# EasyEDA Pro project 车板子.epro

# Schematic Schematic1
Board Name: Board1; Create Date: 2025-12-30; Page Name: P1; Project Name: 毕设; Schematic Name: Schematic1; Update Date: 2026-01-01; Company: 嘉立创EDA; Page Size: A1; Version: V1.0
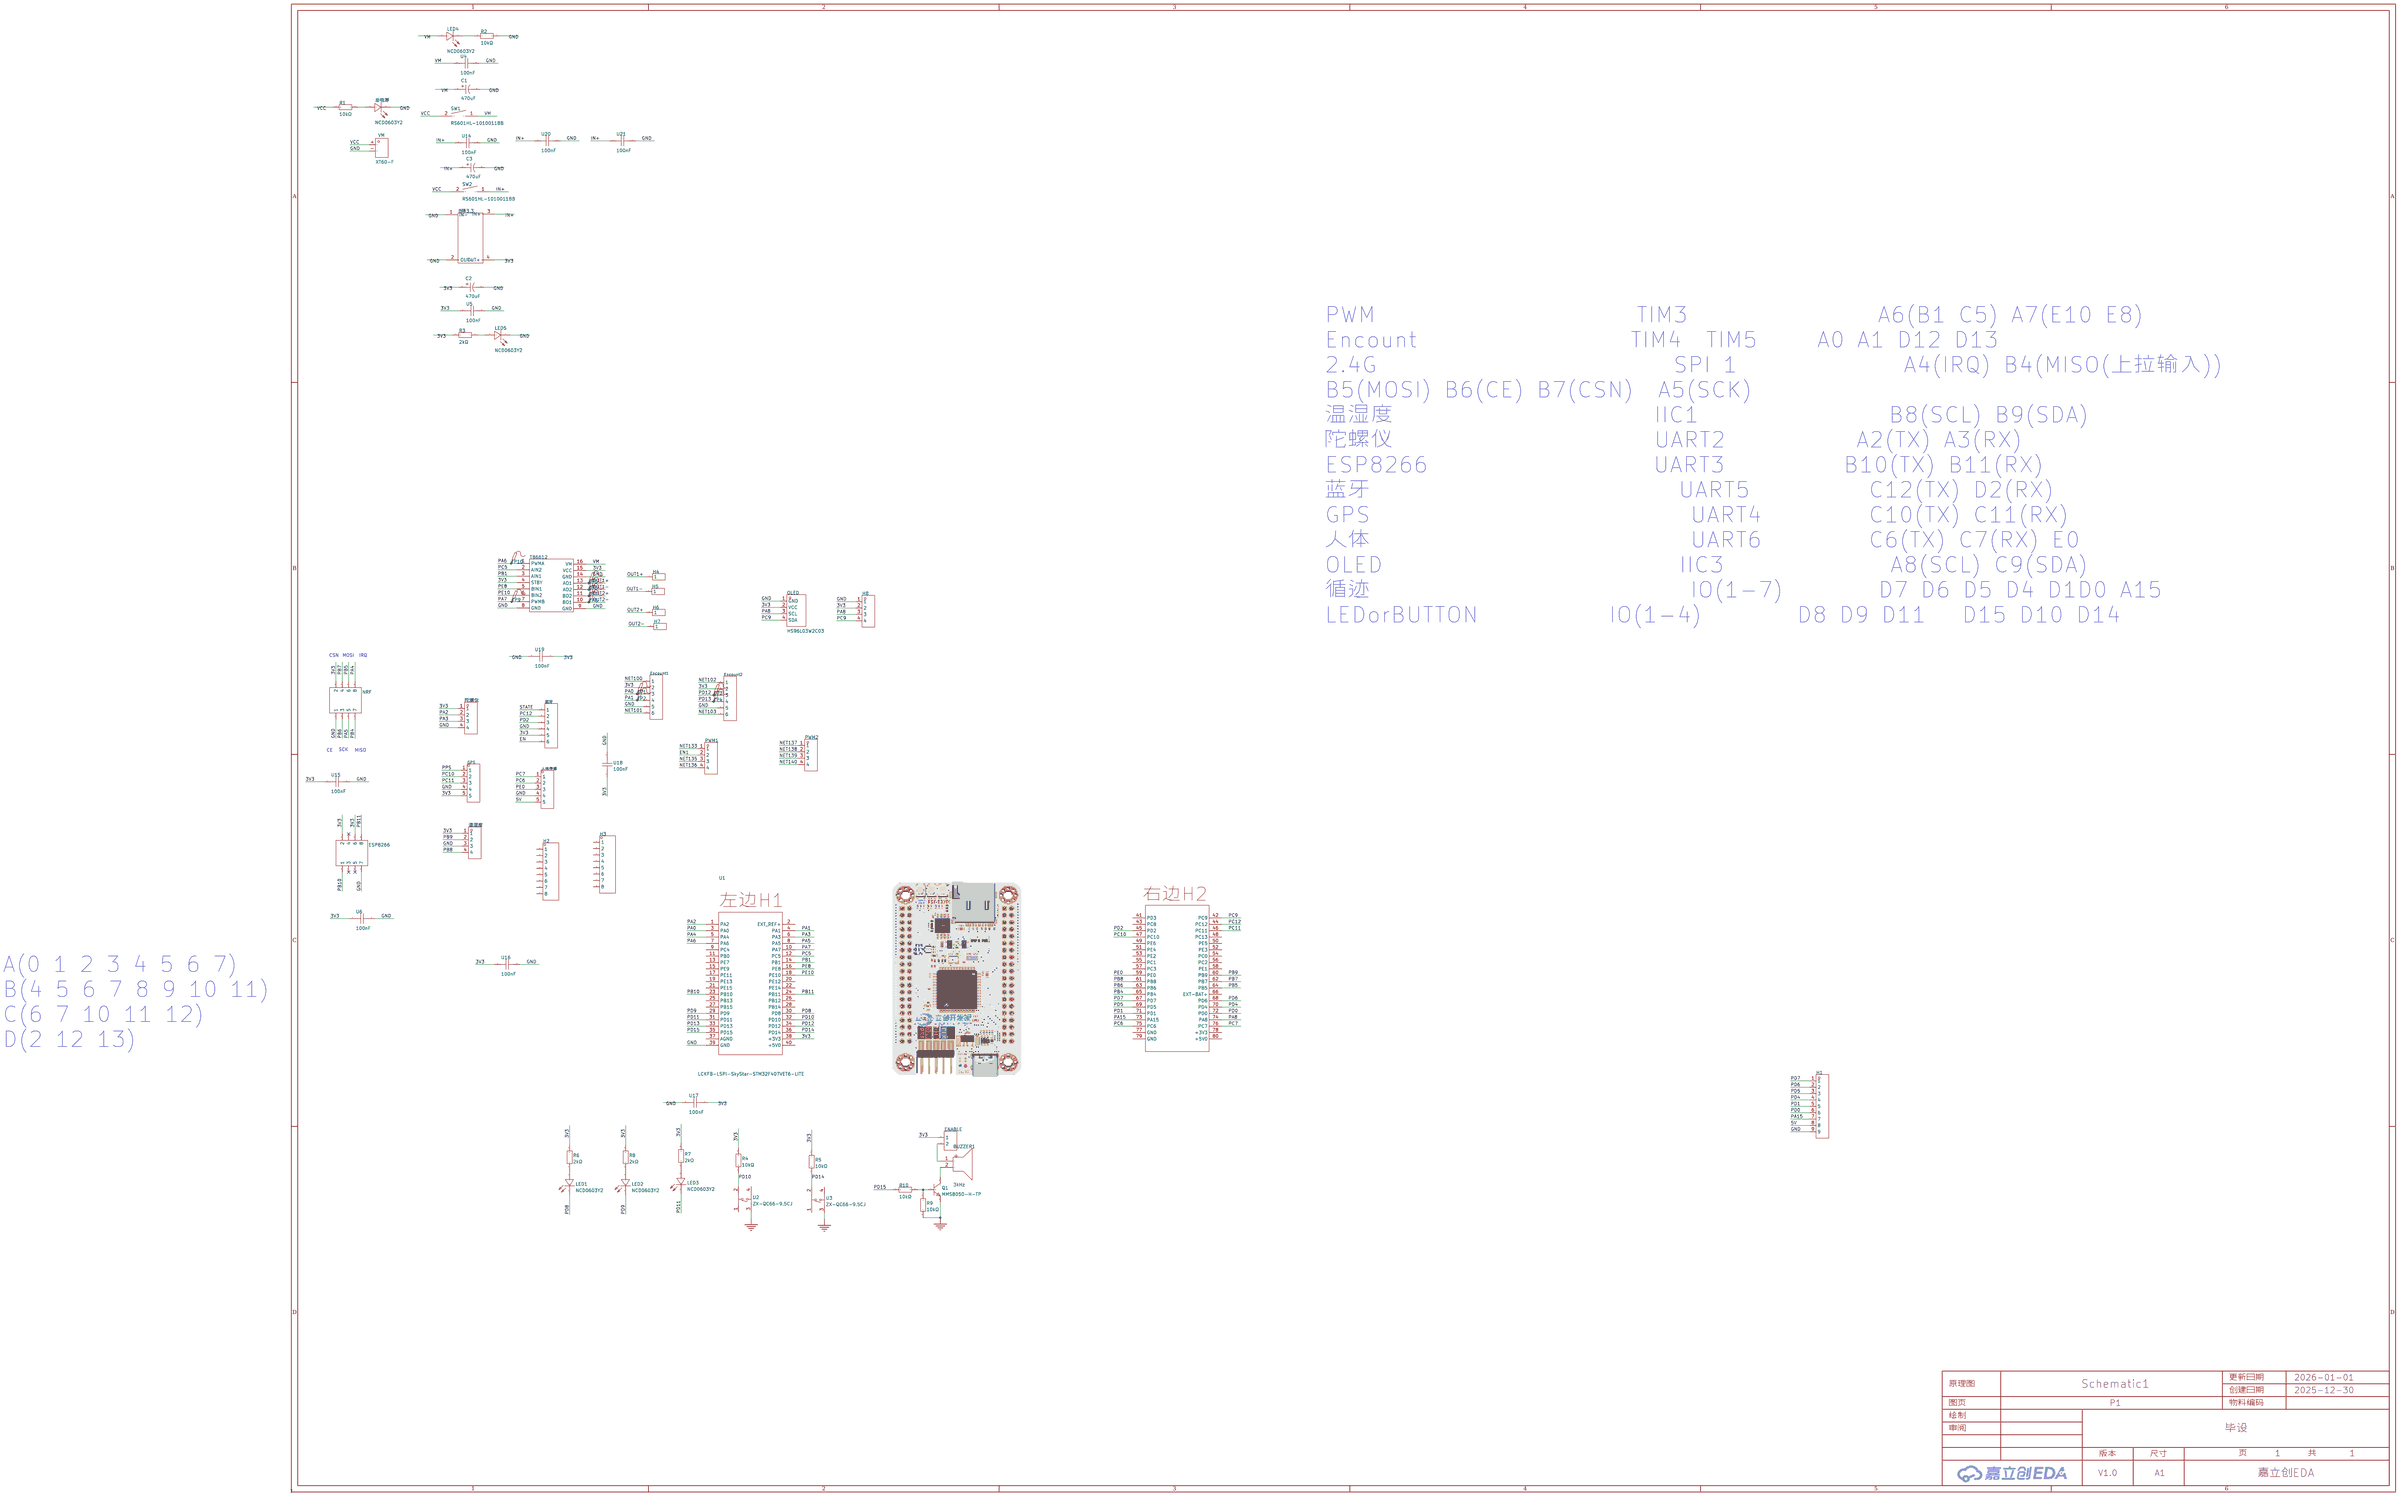
[diagram p0: schematic sheet]

## Parts
8降3.3  -  [DCDC]
BUZZER1  3kHz  [BUZ-TH_BD9.0-P5.00-D0.6-FD]
C1  470uF  [CAP-TH_BD8.0-P3.50-D0.6-FD_1]
C2  470uF  [CAP-TH_BD8.0-P3.50-D0.6-FD_1]
C3  470uF  [CAP-TH_BD8.0-P3.50-D0.6-FD_1]
ENABLE  -  [HDR-TH_2P-P2.54-V-F]
Encount1  -  [HDR-TH_6P-P2.54-V-M-1]
Encount2  -  [HDR-TH_6P-P2.54-V-M-1]
ESP8266  -  [HDR-TH_8P-P2.54-V-F-R2-C4-S2.54-1]
GPS  -  [HDR-TH_5P-P2.54-V-M]
H1  -  [HDR-TH_9P-P2.54-V-M]
H2  -  [HDR-TH_8P-P2.54-V-M]
H3  -  [HDR-TH_8P-P2.54-V-M]
H4  -  [HDR-TH_1P-V-M_XKB_X4611WV-01I-C28D40]
H5  -  [HDR-TH_1P-V-M_XKB_X4611WV-01I-C28D40]
H6  -  [HDR-TH_1P-V-M_XKB_X4611WV-01I-C28D40]
H7  -  [HDR-TH_1P-V-M_XKB_X4611WV-01I-C28D40]
H8  -  [HDR-TH_4P-P2.54-V-M]
LED1  NCD0603Y2  [LED0603-RD]
LED2  NCD0603Y2  [LED0603-RD]
LED3  NCD0603Y2  [LED0603-RD]
LED4  NCD0603Y2  [LED0603-RD]
LED5  NCD0603Y2  [LED0603-RD]
NRF  -  [HDR-TH_8P-P2.54-V-F-R2-C4-S2.54-1]
OLED  HS96L03W2C03  [OLED-TH_L27.8-W27.2-P2.54_C9900033791]
PWM1  -  [HDR-TH_4P-P2.54-V-M]
PWM2  -  [HDR-TH_4P-P2.54-V-M]
Q1  MMS8050-H-TP  [SOT-23-3_L2.9-W1.3-P1.90-LS2.4-BR]
R1  10kΩ  [R0603]
R2  10kΩ  [R0603]
R3  2kΩ  [R0603]
R4  10kΩ  [R0603]
R5  10kΩ  [R0603]
R6  2kΩ  [R0603]
R7  2kΩ  [R0603]
R8  2kΩ  [R0603]
R9  10kΩ  [R0603]
R10  10kΩ  [R0603]
SW1  RS601HL-1010011BB  [SW-TH_RS601HL-1010011BB]
SW2  RS601HL-1010011BB  [SW-TH_RS601HL-1010011BB]
TB6612  -  [TB6612模块]
TP1  -  [Test-Point-0.5mm]
TP2  -  [Test-Point-0.5mm]
TP3  -  [Test-Point-0.5mm]
TP4  -  [Test-Point-0.5mm]
TP5  -  [Test-Point-0.5mm]
TP6  -  [Test-Point-0.5mm]
TP7  -  [Test-Point-0.5mm]
TP8  -  [Test-Point-0.5mm]
TP9  -  [Test-Point-0.5mm]
TP10  -  [Test-Point-0.5mm]
U1  LCKFB-LSPI-SkyStar-STM32F407VET6-LITE  [COMM-TH_LCKFB-LSPI-SKYSTAR-STM32F407VET6-LITE]
U2  ZX-QC66-9.5CJ  [SW-TH_4P-L6.0-W6.0-P4.50-LS6.3]
U3  ZX-QC66-9.5CJ  [SW-TH_4P-L6.0-W6.0-P4.50-LS6.3]
U4  100nF  [C0603]
U5  100nF  [C0603]
U6  100nF  [C0603]
U14  100nF  [C0603]
U15  100nF  [C0603]
U16  100nF  [C0603]
U17  100nF  [C0603]
U18  100nF  [C0603]
U19  100nF  [C0603]
U20  100nF  [C0603]
U21  100nF  [C0603]
VM  XT60-F  [CONN-TH_XT60PB-F]
人体传感  -  [HDR-TH_5P-P2.54-V-M]
总电源  NCD0603Y2  [LED0603-RD]
温湿度  -  [HDR-TH_4P-P2.54-V-M]
蓝牙  -  [HDR-TH_6P-P2.54-V-M-1]
陀螺仪  -  [HDR-TH_4P-P2.54-V-M]

## Library data of the parts
8降3.3 = DCDC
BUZZER1 = HNB09A03: 驱动方式:有源(内含驱动线路);构造类型:电磁式;频率:3kHz;声压(SPL):85dB;; LCSC Part Name: 电磁式有源一体蜂鸣器HNB09A03; Supplier Part: C96102; Manufacturer: 华能; Supplier Footprint: 插件,D=9mm; JLCPCB Part Class: 扩展库; Datasheet: https://item.szlcsc.com/datasheet/HNB09A03/97306.html; Supplier: LCSC; Driver Circuitry: 有源(内含驱动线路); Technology: 电磁式; Voltage - Supply: 1.5V~4.5V; Current Consumption: 30mA; Sound Pressure Level(SPL): 85dB; Diameter(φD): 9mm; Height: 5.5mm; Operating Temperature: -20℃~+70℃
C1-C3 = CD2884771EM0812VFL: 容值:470uF;精度:±20%;额定电压:25V;纹波电流:905mA@100kHz;等效串联电阻(ESR):69mΩ@100kHz;; LCSC Part Name: 470uF ±20% 25V; Supplier Part: C2960233; Manufacturer: HRK(鸿瑞凯电子); Supplier Footprint: 插件,D8xL12mm; JLCPCB Part Class: 扩展库; Datasheet: https://item.szlcsc.com/datasheet/CD2884771EM0812VFL/3346945.html; Supplier: LCSC; Tolerance: ±20%; Voltage Rating: 25V; Ripple Current: 905mA@100kHz; Equivalent Series Resistance(ESR): 69mΩ@100kHz; Pin Spacing: 3.5mm; Diameter: 8mm; Height - Seated (Max): 12mm; Lifetime: 3000hrs@105℃; Operating Temperature: -40℃~+105℃
ENABLE = HDR-F_2.54_1x2P: Supplier Part: C49661; Supplier Footprint: 插件
Encount1 Encount2 蓝牙 = HDR-M_2.54_1x6P: Supplier Part: C37208; Supplier Footprint: 插件
ESP8266 NRF = HDR-F_2.54_2x4: Supplier Part: C92271; Supplier Footprint: 插件
GPS 人体传感 = HDR-M_2.54_1x5P: Supplier Part: C358687; Supplier Footprint: 插件
H1 = HDR-M_2.54-1x9P: Supplier Part: C492408; Supplier Footprint: 插件
H2 H3 = HDR-M_2.54_1x8P: Supplier Part: C124381; Supplier Footprint: 插件
H4-H7 = HDR-M_2.54_1x1P: Supplier Part: C81276; Supplier Footprint: 插件; JLCPCB Part Class: Extended Part
H8 PWM1 PWM2 温湿度 陀螺仪 = HDR-M_2.54_1x4P: Supplier Part: C492403; Supplier Footprint: 插件
LED1-LED5 总电源 = NCD0603Y2: 发光颜色:黄色;正向电压(VF):1.6V~2.6V;功率:65mW;正向电流:20mA;主波长:586nm~595nm;透镜颜色:无色透明透镜;发光强度:100mcd~220mcd;发光角度:130°;工作温度:-30℃~+85℃;; Supplier Part: C89811; Manufacturer: 国星光电; Supplier Footprint: 0603; JLCPCB Part Class: 扩展库; Datasheet: https://atta.szlcsc.com/upload/public/pdf/source/20200820/C89811_7FE84B429B6BCA3E113B125EE1452576.pdf; Supplier: LCSC; Emitted Color: 黄色; Forward Voltage (VF): 1.6V~2.6V; Power Dissipation: 65mW; Forward Current: 20mA; Dominant Wavelength: 586nm~595nm; Lens Color: 无色透明透镜; Luminous Intensity: 100mcd~220mcd; Viewing Angle: 130°; Operating Temperature: -30℃~+85℃
OLED = HS96L03W2C03: 主控芯片:SSD1315;接口类型:I2C;尺寸(inch):0.96;像素分辨率:128x64;; LCSC Part Name: 0.96寸OLED显示屏窄白光IIC; Supplier Part: C5248080; Manufacturer: HS(汉昇); JLCPCB Part Class: 扩展库; Datasheet: https://atta.szlcsc.com/upload/public/pdf/source/20230627/763D01F79A90007632F098068C7C8AD9.pdf; Supplier: LCSC; Main Control Chip: SSD1315; Interface Type: I2C; Size: 0.96; Pixel Resolution: 128x64; Operating Temperature: -40℃~+70℃
Q1 = MMS8050-H-TP: 晶体管类型:NPN;集电极电流(Ic):500mA;集射极击穿电压(Vceo):25V;耗散功率(Pd):300mW;直流电流增益(hFE):120@50mA,1V;; Supplier Part: C668971; Manufacturer: MCC(美微科); Supplier Footprint: SOT-23; JLCPCB Part Class: 扩展库; Datasheet: https://atta.szlcsc.com/upload/public/pdf/source/20200618/C668971_E8C4278A0C61D2294D468F2197C24659.pdf; Supplier: LCSC; type: NPN; Current - Collector(Ic): 500mA; Collector - Emitter Voltage VCEO: 25V; Pd - Power Dissipation: 300mW; DC Current Gain: 120@50mA,1V; Transition frequency(fT): 150MHz; Current - Collector Cutoff: 100nA; Vce Saturation(VCE(sat)): 600mV; Operating Temperature: -55℃~+150℃@(Tj)
R1-R10 = 0603WAF4701T5E: 电阻类型:厚膜电阻;阻值:4.7kΩ;精度:±1%;功率:100mW;工作电压:75V;温度系数:±100ppm/℃;; LCSC Part Name: 4.7kΩ ±1% 100mW 厚膜电阻; Supplier Part: C23162; Manufacturer: UNI-ROYAL(厚声); Supplier Footprint: 0603; JLCPCB Part Class: 基础库; Datasheet: https://item.szlcsc.com/datasheet/0603WAF4701T5E/23889.html; Supplier: LCSC; Type: 厚膜电阻; Tolerance: ±1%; Power(Watts): 100mW; Voltage-Supply(Max): 75V; Temperature Coefficient: ±100ppm/℃; Operating Temperature: -55℃~+155℃
SW1 SW2 = RS601HL-1010011BB: 带灯:无;引脚样式:焊片;额定电流:3A;额定电压(AC):250V;额定电压(DC):-;电路结构:单刀单掷;机械寿命:1万次;; Supplier Part: C2885782; Manufacturer: HCTL(华灿天禄); Supplier Footprint: 插件; JLCPCB Part Class: 扩展库; Datasheet: https://atta.szlcsc.com/upload/public/pdf/source/20210820/B1970E40D09304D7FA648AE2099FB3E8.pdf; Supplier: LCSC; Switch Length: 15mm; Switch Width: 10.5mm; Switch Height: 11.7mm; Actuator Type: 凹面弯曲; With Lamp: 无; Pin Style: 焊片; Actuator Color: 黑色; Contact Current: 3A; Voltage Rating (AC): 250V; Circuit: 单刀单掷; Mechanical Life: 1万次; Operating Temperature: -25℃~+85℃; Actuator Identifier: - O
TB6612 = TB6612模块
TP1-TP10 = Test-Point: Test Point 测试点
U1 = LCKFB-LSPI-SkyStar-STM32F407VET6-LITE: 单板,不送排针; LCSC Part Name: 立创·天空星开发板-STM32F407VET6-青春版; Supplier Part: C22370035; Manufacturer: 立创开发板; JLCPCB Part Class: Extended Part; Datasheet: https://item.szlcsc.com/datasheet/LCKFB-LSPI-SkyStar-STM32F407VET6-LITE/23849165.html; Supplier: LCSC
U2 U3 = ZX-QC66-9.5CJ: 电路结构:单刀单掷;按钮形状:圆形按钮;作用力:2.6N;安装方式:直插;开关长度:6mm;开关宽度:6mm;开关高度:9.5mm;带支架:不带支架;触点电流:50mA;额定电压:12V;工作寿命:10万次;; LCSC Part Name: 6*6*9.5插件; Supplier Part: C7470135; Manufacturer: Megastar(兆星); Supplier Footprint: 插件; JLCPCB Part Class: 扩展库; Datasheet: https://item.szlcsc.com/datasheet/ZX-QC66-9.5CJ/8519141.html; Supplier: LCSC; Circuit: 单刀单掷; Actuator Style: 圆形按钮; Operating Force: 2.6N; Mounting Type: 直插; Length: 6mm; Width: 6mm; Switch Height: 9.5mm; with Bracket: 不带支架; Contact Current: 50mA; Voltage Rating: 12V; Actuator/Cap Color: 黑色; Termination Style: PC引脚; Life: 10万次; Operating Temperature: -30℃~+80℃
U4-U6 U14-U21 = VJ0603A470FXACW1BC: 容值:47pF;精度:±1%;额定电压:50V;温度系数:C0G;; LCSC Part Name: 47pF ±1% 50V; Supplier Part: C3848767; Manufacturer: VISHAY(威世); Supplier Footprint: 0603; JLCPCB Part Class: 扩展库; Datasheet: https://item.szlcsc.com/datasheet/VJ0603A470FXACW1BC/4417253.html; Supplier: LCSC; Tolerance: ±1%; Voltage Rating: 50V; Temperature Coefficient: C0G
VM = XT60-F: 类别:-;类型1:-;; LCSC Part Name: AMASS(艾迈斯)XT60模型插头 3.5mm镀金香蕉头母头 XT60-F; Supplier Part: C98734; Manufacturer: AMASS(艾迈斯); JLCPCB Part Class: 扩展库; Datasheet: https://atta.szlcsc.com/upload/public/pdf/source/20170606/1496716532533.pdf; Supplier: LCSC; Type: 香蕉头; Colour: 黄色; InterfaceType: 母头; MetalMaterial: 镀金

## Nets
3V3: 8降3.3.4(OUT+) C2.1 ENABLE.1 Encount1.2 Encount2.2 ESP8266.2 ESP8266.6 GPS.5 H8.2 NRF.2 OLED.2(VCC) R3.2 R4.2 R5.2 R6.2 R7.2 R8.2 TB6612.4(STBY) TB6612.15(VCC) U1.38(+3V3) U5.1 U6.1 U15.1 U16.1 U17.1 U18.1 U19.1 温湿度.1 蓝牙.5 陀螺仪.1
5V: H1.8 人体传感.5
GND: 8降3.3.1(IN-) 8降3.3.2(OUT-) C1.2 C2.2 C3.2 Encount1.5 Encount2.5 ESP8266.7 GPS.4 H1.9 H8.1 LED5.1(K) NRF.1 OLED.1(GND) Q1.2(E) R2.1 R9.2 TB6612.8(GND) TB6612.9(GND) TB6612.14(GND) U1.39(GND) U2.3 U3.3 U4.2 U5.2 U6.2 U14.2 U15.2 U16.2 U17.2 U18.2 U19.2 U20.2 U21.2 VM.-(2) 人体传感.4 总电源.1(K) 温湿度.3 蓝牙.4 陀螺仪.4
VCC: R1.2 SW1.2 SW2.2 VM.+(1)
EN: 蓝牙.6
EN1: PWM1.2
IN+: 8降3.3.3(IN+) C3.1 SW2.1 U14.1 U20.1 U21.1
NET100: Encount1.1
NET101: Encount1.6
NET102: Encount2.1
NET103: Encount2.6
NET133: PWM1.1
NET135: PWM1.3
NET136: PWM1.4
NET137: PWM2.1
NET138: PWM2.2
NET139: PWM2.3
NET140: PWM2.4
OUT1+: H4.1 TB6612.13(AO1) TP5.1
OUT1-: H5.1 TB6612.12(AO2) TP6.1
OUT2+: H6.1 TB6612.11(BO2) TP7.1
OUT2-: H7.1 TB6612.10(BO1) TP8.1
PA0: Encount1.3 TP1.1 U1.3(PA0)
PA1: Encount1.4 TP2.1 U1.4(PA1)
PA2: U1.1(PA2) 陀螺仪.2
PA3: U1.6(PA3) 陀螺仪.3
PA4: NRF.8 U1.5(PA4)
PA5: NRF.5 U1.8(PA5)
PA6: TB6612.1(PWMA) TP10.1 U1.7(PA6)
PA7: TB6612.7(PWMB) TP9.1 U1.10(PA7)
PA8: H8.3 OLED.3(SCL) U1.74(PA8)
PA15: H1.7 U1.73(PA15)
PB1: TB6612.3(AIN1) U1.14(PB1)
PB4: NRF.7 U1.65(PB4)
PB5: NRF.6 U1.64(PB5)
PB6: NRF.3 U1.63(PB6)
PB7: NRF.4 U1.62(PB7)
PB8: U1.61(PB8) 温湿度.4
PB9: U1.60(PB9) 温湿度.2
PB10: ESP8266.1 U1.23(PB10)
PB11: ESP8266.8 U1.24(PB11)
PC5: TB6612.2(AIN2) U1.12(PC5)
PC6: U1.75(PC6) 人体传感.2
PC7: U1.76(PC7) 人体传感.1
PC9: H8.4 OLED.4(SDA) U1.42(PC9)
PC10: GPS.2 U1.47(PC10)
PC11: GPS.3 U1.46(PC11)
PC12: U1.44(PC12) 蓝牙.2
PD0: H1.6 U1.72(PD0)
PD1: H1.5 U1.71(PD1)
PD2: U1.45(PD2) 蓝牙.3
PD4: H1.4 U1.70(PD4)
PD5: H1.3 U1.69(PD5)
PD6: H1.2 U1.68(PD6)
PD7: H1.1 U1.67(PD7)
PD8: LED1.1(K) U1.30(PD8)
PD9: LED2.1(K) U1.29(PD9)
PD10: R4.1 U1.32(PD10) U2.2
PD11: LED3.1(K) U1.31(PD11)
PD12: Encount2.3 TP3.1 U1.34(PD12)
PD13: Encount2.4 TP4.1 U1.33(PD13)
PD14: R5.1 U1.36(PD14) U3.2
PD15: R10.1 U1.35(PD15)
PE0: U1.59(PE0) 人体传感.3
PE8: TB6612.5(BIN1) U1.16(PE8)
PE10: TB6612.6(BIN2) U1.18(PE10)
PPS: GPS.1
STATE: 蓝牙.1
VM: C1.1 LED4.2(A) SW1.1 TB6612.16(VM) U4.1
Net-(BUZZER1-1): BUZZER1.1(+) ENABLE.2
Net-(BUZZER1-2): BUZZER1.2(-) Q1.3(C)
Net-(LED1-2): LED1.2(A) R6.1
Net-(LED2-2): LED2.2(A) R8.1
Net-(LED3-2): LED3.2(A) R7.1
Net-(LED4-1): LED4.1(K) R2.2
Net-(LED5-2): LED5.2(A) R3.1
Net-(Q1-1): Q1.1(B) R9.1 R10.2
Net-(R1-1): R1.1 总电源.2(A)

Not connected (* = marked no-connect by the designer): ESP8266 3* 4* 5*; H2 1 2 3 4 5 6 7 8; H3 1 2 3 4 5 6 7 8; U1 2(EXT REF+) 9(PC4) 11(PB0) 13(PE7) 15(PE9) 17(PE11) 19(PE13) 20(PE12) 21(PE15) 22(PE14) 25(PB13) 26(PB12) 27(PB15) 28(PB14) 37(AGND) 40(+5V0) 41(PD3) 43(PC8) 48(PC13) 49(PE6) 50(PE5) 51(PE4) 52(PE3) 53(PE2) 54(PC0) 55(PC1) 56(PC2) 57(PC3) 58(PE1) 66(EXT-BAT+) 77(GND) 78(+3V3) 79(GND) 80(+5V0); U2 1 4; U3 1 4

## Notes on the sheet
- PWM                      TIM3                A6(B1 C5) A7(E10 E8)
  Encount                  TIM4  TIM5     A0 A1 D12 D13
  2.4G                         SPI 1              A4(IRQ) B4(MISO(上拉输入))
  B5(MOSI) B6(CE) B7(CSN)  A5(SCK)
  温湿度                      IIC1                B8(SCL) B9(SDA)
  陀螺仪                      UART2           A2(TX) A3(RX)
  ESP8266                   UART3          B10(TX) B11(RX)
  蓝牙                          UART5          C12(TX) D2(RX)
  GPS                           UART4         C10(TX) C11(RX)
  人体                           UART6         C6(TX) C7(RX) E0
  OLED                         IIC3              A8(SCL) C9(SDA)
  循迹                           IO(1-7)        D7 D6 D5 D4 D1D0 A15
  LEDorBUTTON           IO(1-4)        D8 D9 D11   D15 D10 D14
- CSN
- MOSI
- IRQ
- CE
- SCK
- MISO
- A(0 1 2 3 4 5 6 7)
  B(4 5 6 7 8 9 10 11)
  C(6 7 10 11 12)
  D(2 12 13)

# Board PCB1
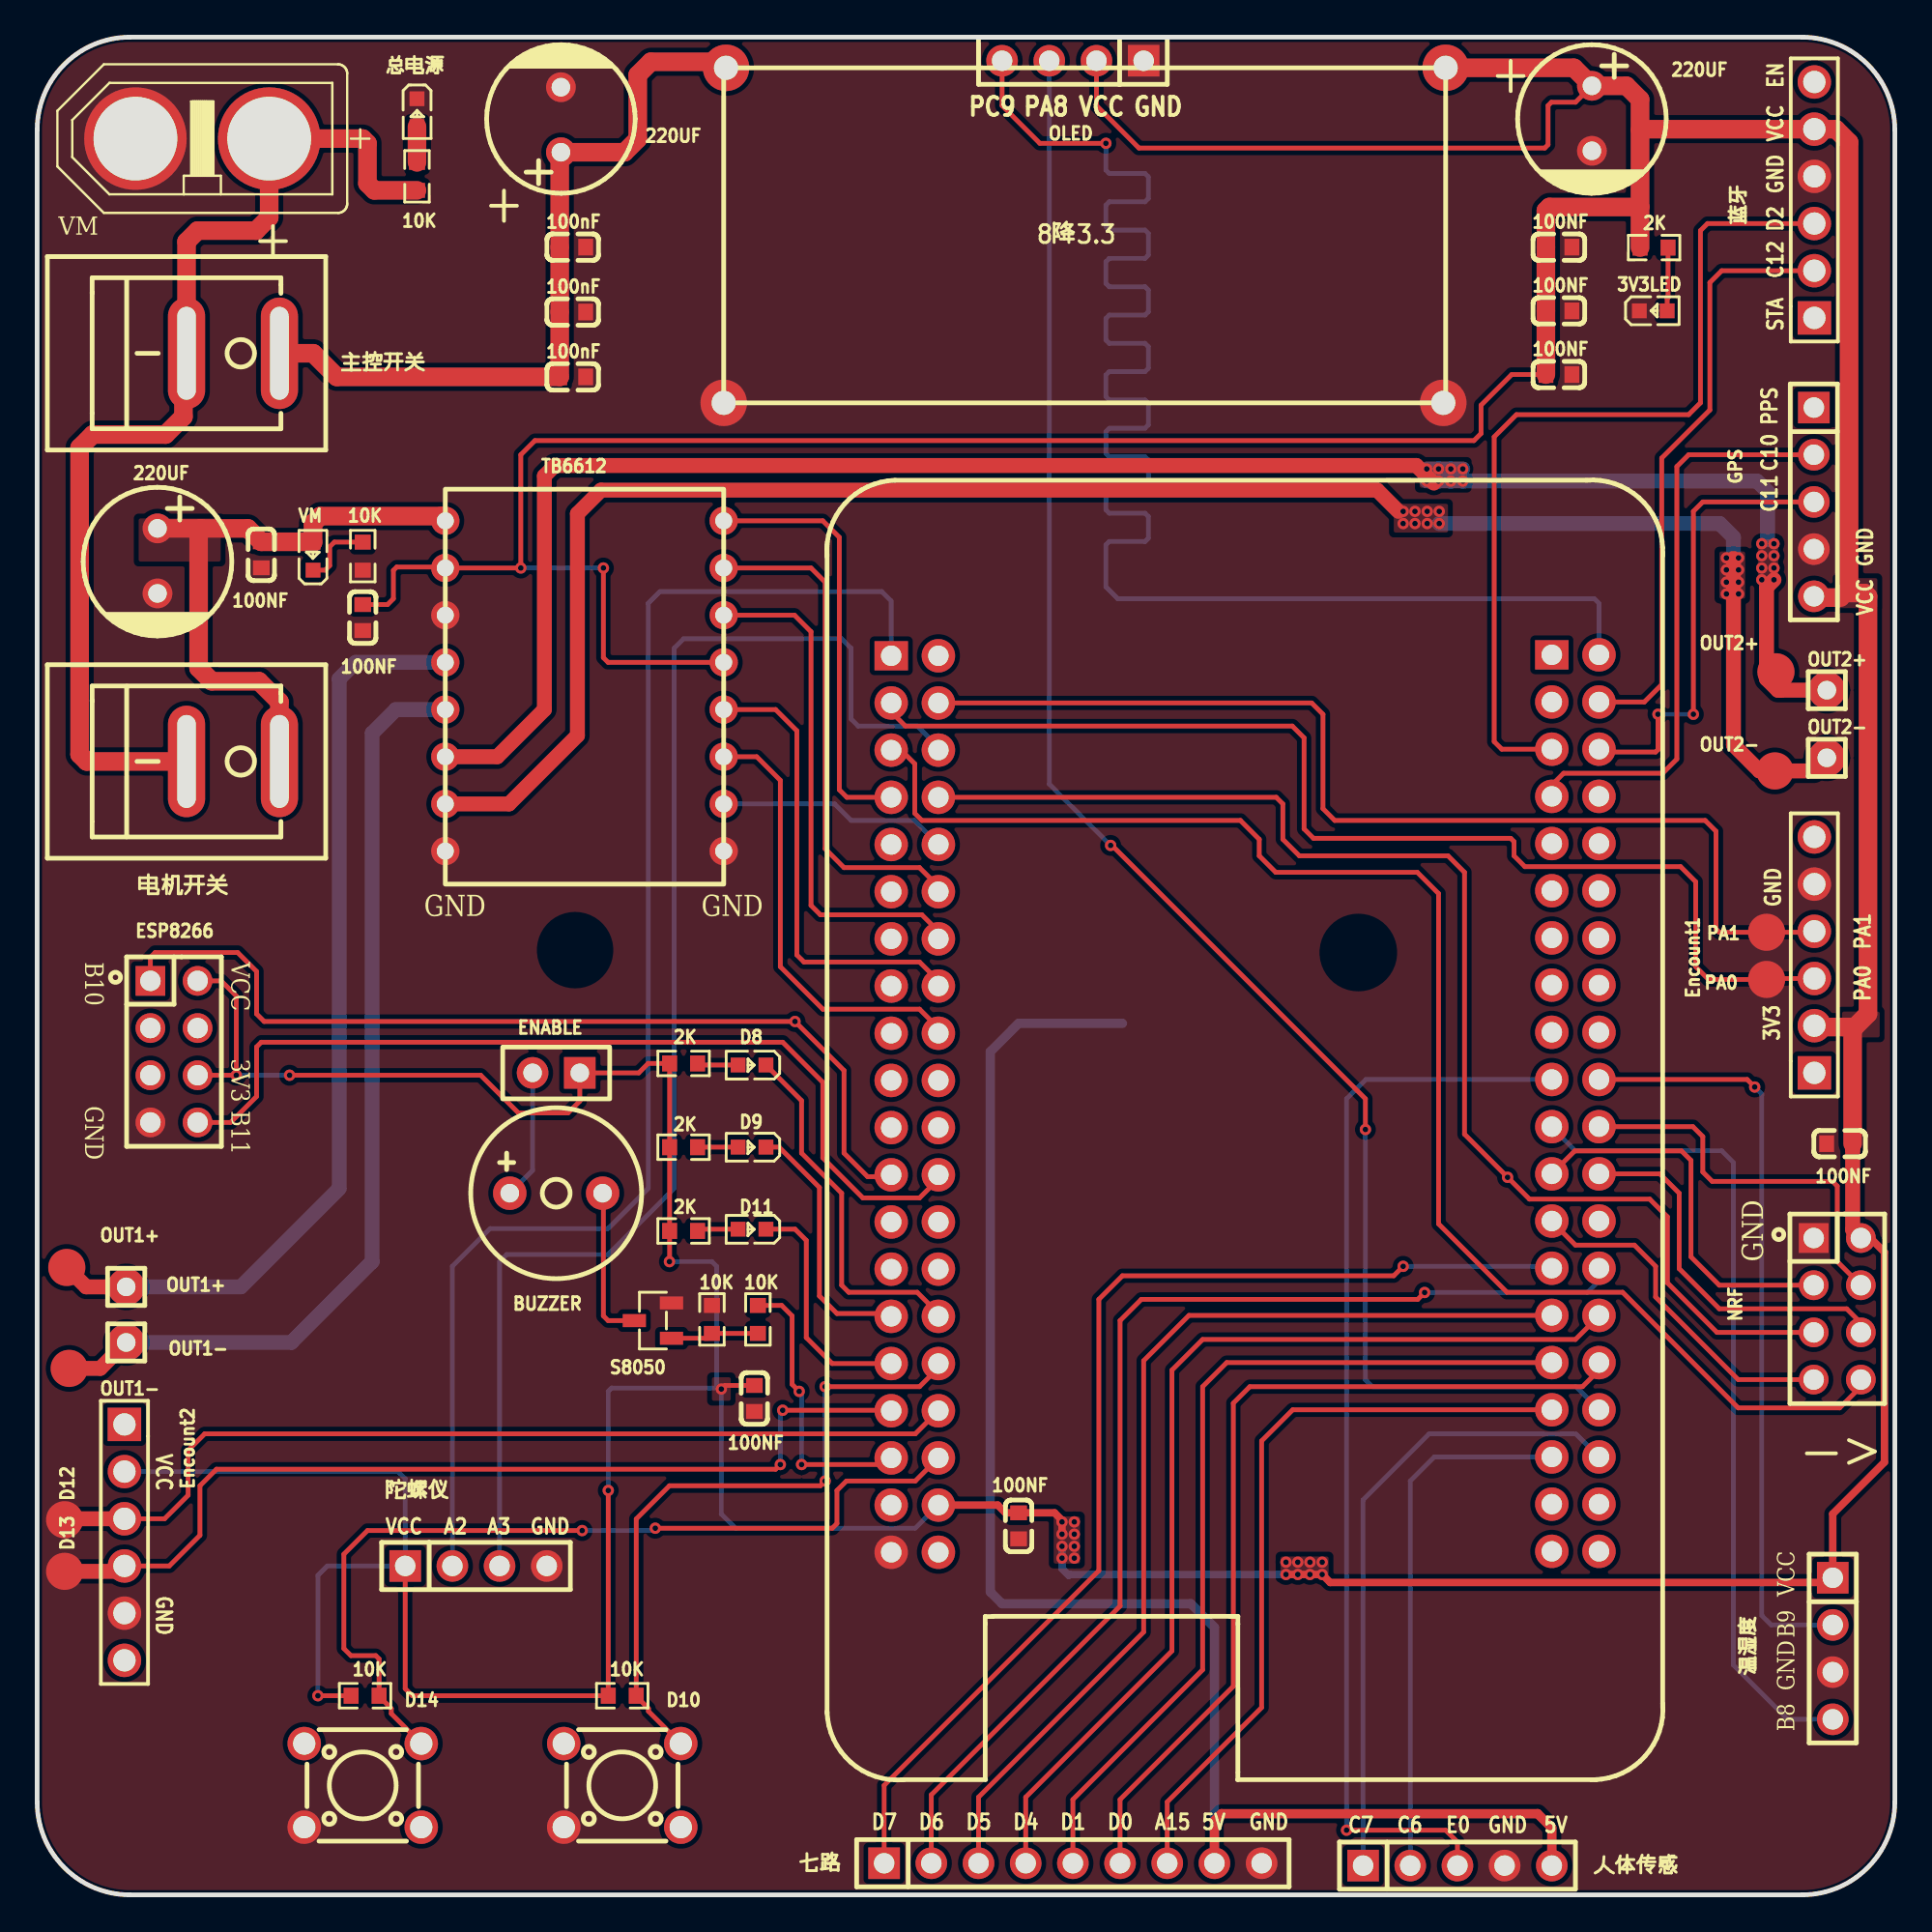
[diagram p1: board, top side]
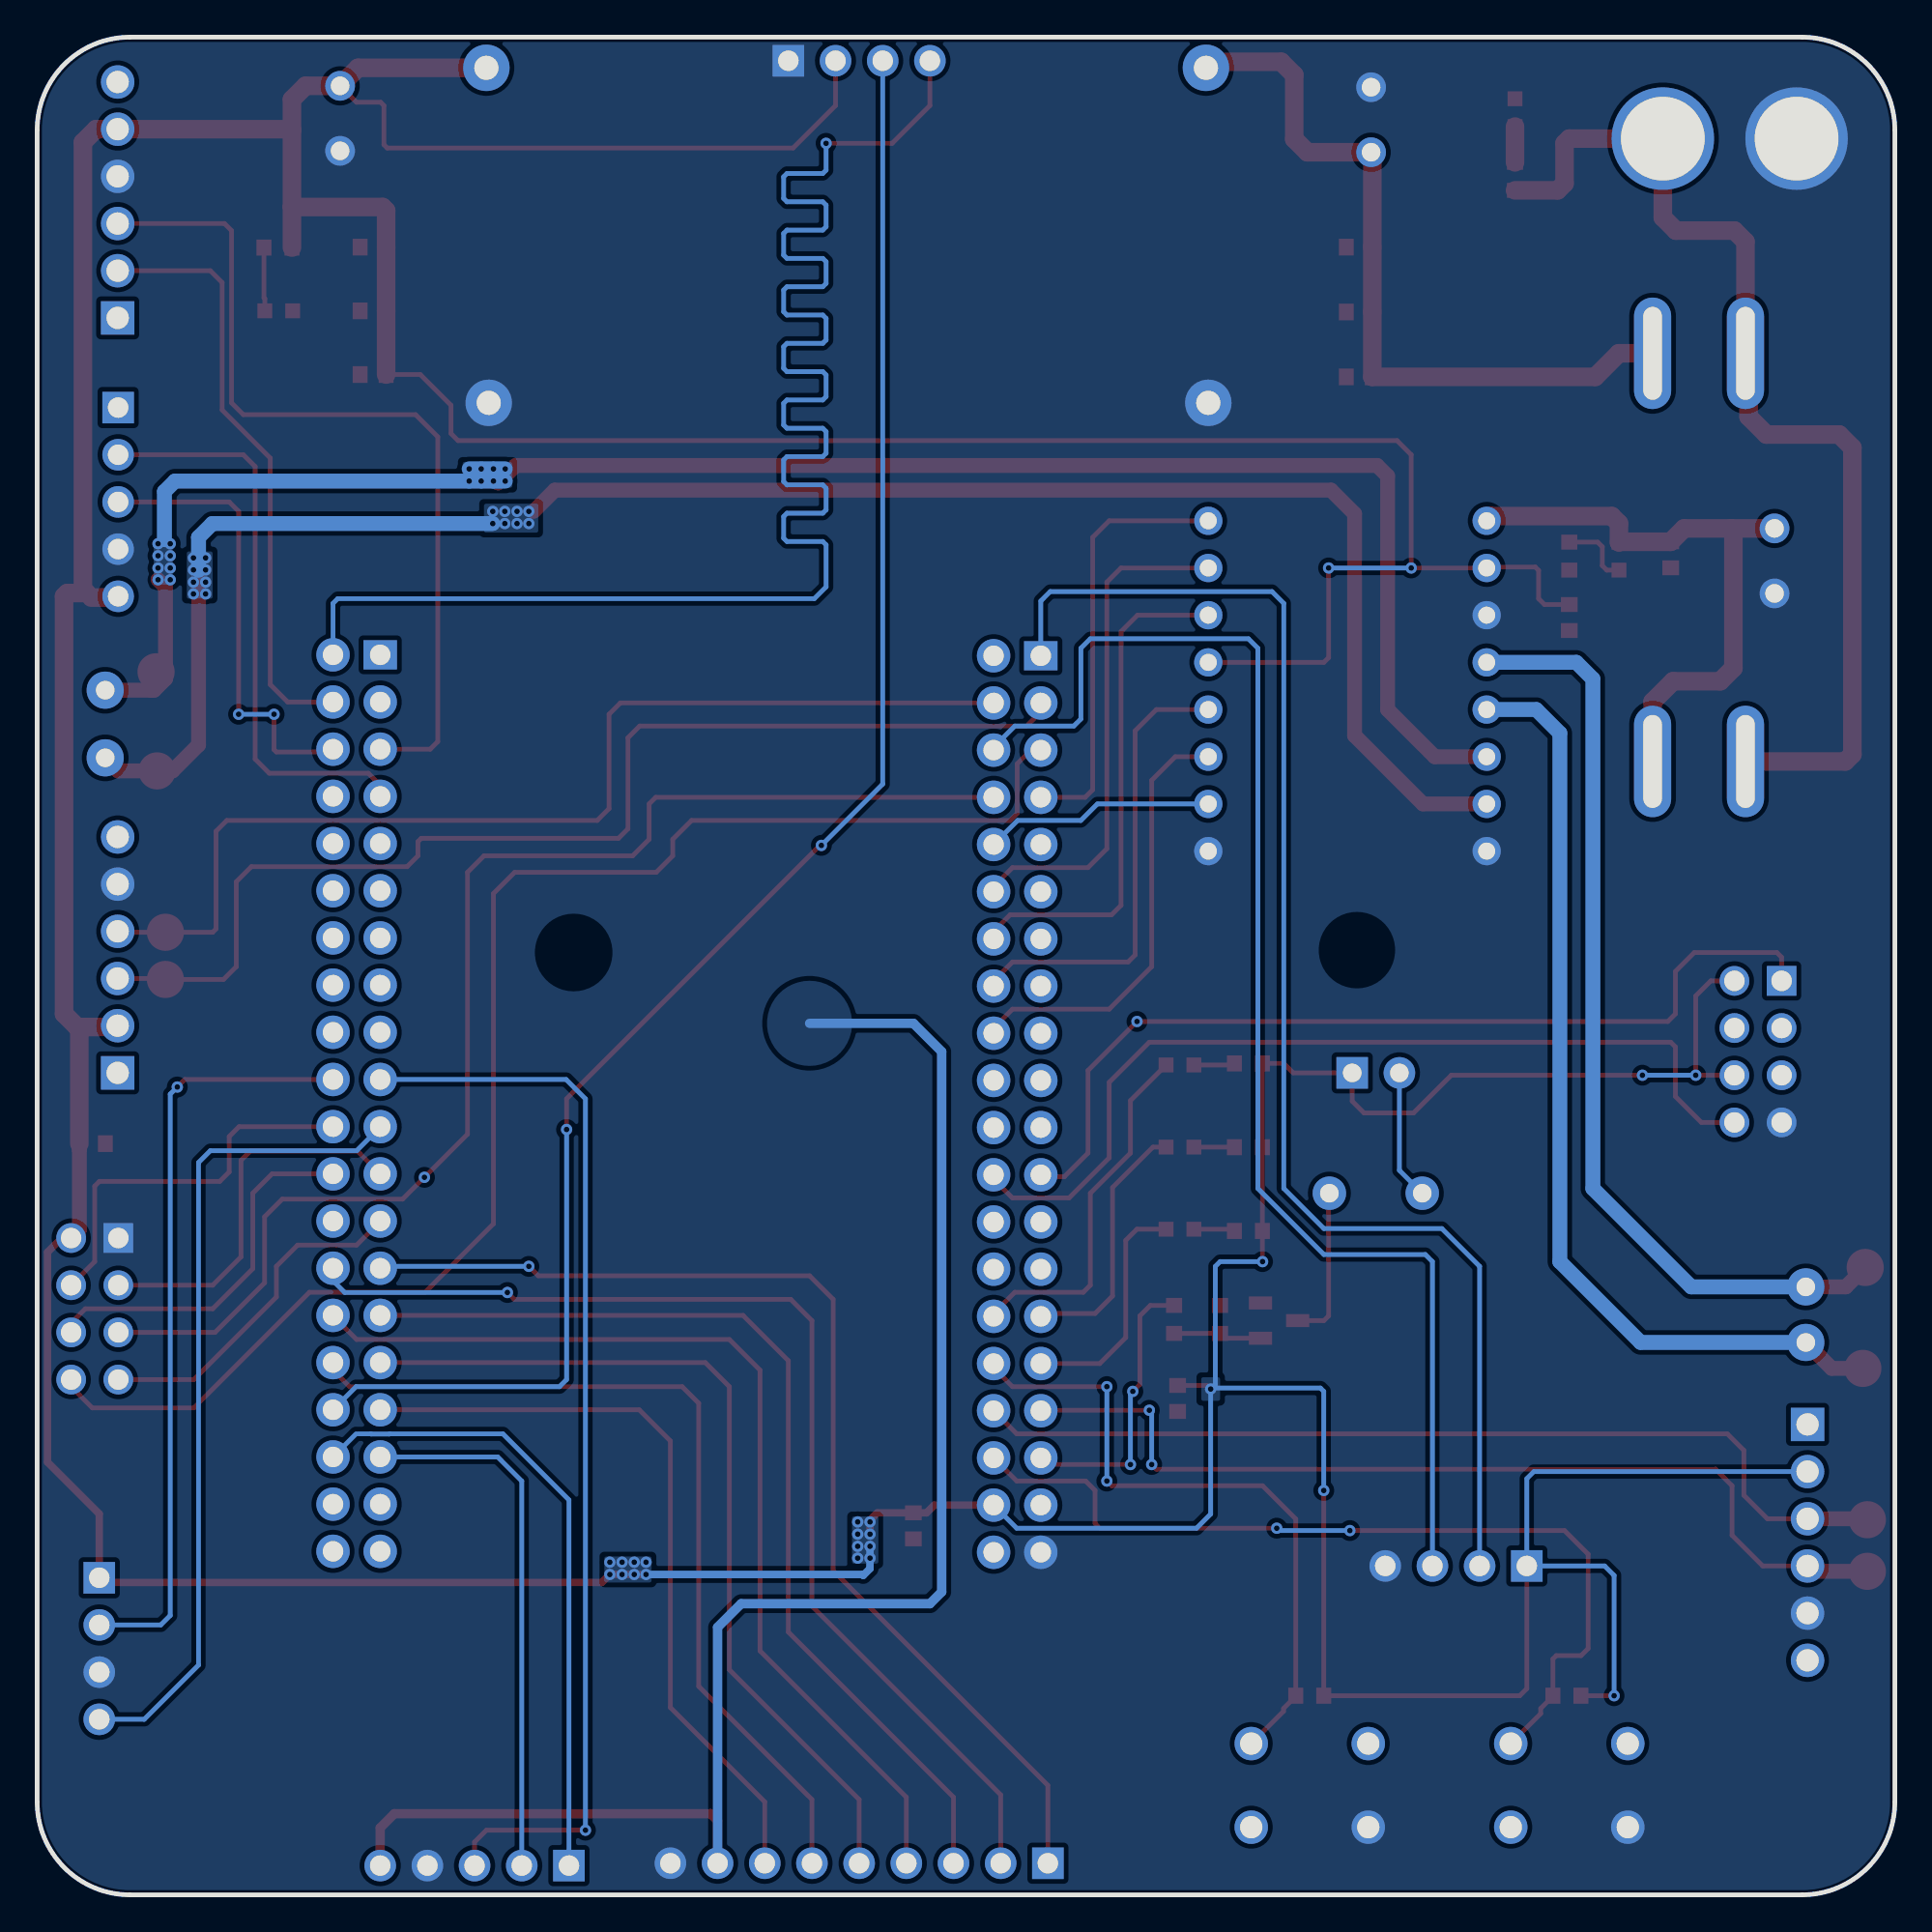
[diagram p2: board, bottom side, seen from below]

Outline 100 x 100 mm; copper layers: Top Layer, Bottom Layer. Coordinates in mm from the lower left corner of the outline.
Outline path: 0,95 0,5 arc(1.46,1.46) 5,0 95,0 arc(98.54,1.46) 100,5 100,95 arc(98.54,98.54) 95,100 5,100 arc(1.46,98.54) 0,95
Stack: Top Layer 0.035mm / Dielectric1 1.51mm FR4 er 4.5 / Bottom Layer 0.035mm

## Design rules (mm)
net PA8: IIC1
net PC9: IIC1
template: 自定义配置
spacing copperThickness1oz (default): track to track 0.102, other pairs 0.152 to 0.3
spacing copperThickness2oz: track to track 0.203, other pairs 0.152 to 0.3
track width copperThickness1oz (default): min 0.127, default 0.254, max 2.54
track width copperThickness2oz: min 0.203, default 0.254, max 2.54
differential pair differentialPair (default): width min 0.127, default 0.254, max 2.54; gap min 0.152, default 0.152
via viaSize (default): diameter min 0.5, default 0.61, max 10; hole min 0.3, default 0.305, max 6.3

## Placement (name value [footprint] x y rotation side)
2K  -  [R0603]  87.04 88.67 180 top
2K#2  -  [R0603]  34.8 44.76 180 top
2K#3  -  [R0603]  34.8 35.74 180 top
2K#4  -  [R0603]  34.8 40.25 180 top
3V3LED  NCD0603Y2  [LED0603-RD]  87 85.27 0 top
8降3.3  -  [DCDC]  56.39 89.33 90 top
10K  -  [R0603]  20.45 92.51 270 top
10K#2  -  [R0603]  17.53 72.06 90 top
10K#3  -  [R0603]  31.5 10.72 180 top
10K#4  -  [R0603]  17.65 10.72 180 top
10K#5  -  [R0603]  36.32 30.98 90 top
10K#6  -  [R0603]  38.8 30.98 270 top
100nF  -  [C0603]  28.83 85.2 0 top
100NF  -  [C0603]  12.06 72.14 270 top
100NF#2  -  [C0603]  38.61 26.72 270 top
100nF#2  -  [C0603]  28.83 88.7 0 top
100NF#3  -  [C0603]  81.91 81.84 0 top
100nF#3  -  [C0603]  28.83 81.71 0 top
100NF#4  -  [C0603]  17.53 68.76 270 top
100NF#5  -  [C0603]  52.83 19.86 270 top
100NF#6  -  [C0603]  97.03 40.44 180 top
100NF#7  -  [C0603]  81.91 88.7 0 top
100NF#8  -  [C0603]  81.91 85.27 0 top
220UF  -  [CAP-TH_BD8.0-P3.50-D0.6-FD_1]  6.48 71.81 270 top
220UF#2  -  [CAP-TH_BD8.0-P3.50-D0.6-FD_1]  83.69 95.63 270 top
220UF#3  -  [CAP-TH_BD8.0-P3.50-D0.6-FD_1]  28.19 95.56 90 top
BUZZER  3kHz  [BUZ-TH_BD9.0-P5.00-D0.6-FD]  27.94 37.77 0 top
D8  NCD0603Y2  [LED0603-RD]  38.48 44.67 180 top
D9  NCD0603Y2  [LED0603-RD]  38.48 40.25 180 top
D10  ZX-QC66-9.5CJ  [SW-TH_4P-L6.0-W6.0-P4.50-LS6.3]  31.5 5.89 0 top
D11  NCD0603Y2  [LED0603-RD]  38.48 35.83 180 top
D12  -  [Test-Point-0.5mm]  1.48 20.19 0 top
D13  -  [Test-Point-0.5mm]  1.48 17.42 0 top
D14  ZX-QC66-9.5CJ  [SW-TH_4P-L6.0-W6.0-P4.50-LS6.3]  17.53 5.89 0 top
ENABLE  -  [HDR-TH_2P-P2.54-V-F]  27.94 44.25 180 top
Encount1  -  [HDR-TH_6P-P2.54-V-M-1]  95.67 50.6 90 top
Encount2  -  [HDR-TH_6P-P2.54-V-M-1]  4.7 18.97 270 top
ESP8266  -  [HDR-TH_8P-P2.54-V-F-R2-C4-S2.54-1]  7.37 45.39 270 top
GPS  -  [HDR-TH_5P-P2.54-V-M]  95.64 74.98 270 top
NRF  -  [HDR-TH_8P-P2.54-V-F-R2-C4-S2.54-1]  96.9 31.55 270 top
OLED  HS96L03W2C03  [HDR-TH_4P-P2.54-V-M]  55.75 98.73 180 top
OUT1+  -  [Test-Point-0.5mm]  1.6 33.77 0 top
OUT1+#2  -  [HDR-TH_1P-V-M_XKB_X4611WV-01I-C28D40]  4.79 32.73 0 top
OUT1-  -  [HDR-TH_1P-V-M_XKB_X4611WV-01I-C28D40]  4.79 29.74 0 top
OUT1-#2  -  [Test-Point-0.5mm]  1.72 28.34 0 top
OUT2+  -  [HDR-TH_1P-V-M_XKB_X4611WV-01I-C28D40]  96.34 64.85 0 top
OUT2+#2  -  [Test-Point-0.5mm]  93.6 65.84 0 top
OUT2-  -  [HDR-TH_1P-V-M_XKB_X4611WV-01I-C28D40]  96.34 61.21 0 top
OUT2-#2  -  [Test-Point-0.5mm]  93.54 60.5 0 top
PA0  -  [Test-Point-0.5mm]  93.09 49.28 180 top
PA1  -  [Test-Point-0.5mm]  93.09 51.82 180 top
S8050  MMS8050-H-TP  [SOT-23-3_L2.9-W1.3-P1.90-LS2.4-BR]  33.15 30.91 0 top
TB6612  -  [TB6612模块]  29.59 71.93 0 top
U1  LCKFB-LSPI-SkyStar-STM32F407VET6-LITE  [COMM-TH_LCKFB-LSPI-SKYSTAR-STM32F407VET6-LITE]  65.02 42.6 0 top
VM  XT60-F  [LED0603-RD]  14.85 72.06 90 top
VM#2  -  [CONN-TH_XT60PB-F]  8.89 94.54 0 top
七路  -  [HDR-TH_9P-P2.54-V-M]  55.75 1.7 0 top
主控开关  RS601HL-1010011BB  [SW-TH_RS601HL-1010011BB]  10.54 82.98 180 top
人体传感  -  [HDR-TH_5P-P2.54-V-M]  76.45 1.58 0 top
总电源  NCD0603Y2  [LED0603-RD]  20.45 95.94 270 top
温湿度  -  [HDR-TH_4P-P2.54-V-M]  96.66 13.26 270 top
电机开关  RS601HL-1010011BB  [SW-TH_RS601HL-1010011BB]  10.54 61.01 180 top
蓝牙  -  [HDR-TH_6P-P2.54-V-M-1]  95.67 91.24 90 top
陀螺仪  -  [HDR-TH_4P-P2.54-V-M]  23.62 17.7 0 top

## Footprints (pads in the part's own frame, mm; a bottom-side part is the same pattern mirrored in y, then rotated)
BUZ-TH_BD9.0-P5.00-D0.6-FD
  round 1.8 hole 1: 1(-2.5,0) 2(2.5,0)
C0603
  rect 0.8x0.9 smd: 1(-0.7,0) 2(0.7,0)
CAP-TH_BD8.0-P3.50-D0.6-FD_1
  round 1.6 hole 1: 1(-1.75,0) 2(1.75,0)
COMM-TH_LCKFB-LSPI-SKYSTAR-STM32F407VET6-LITE
  rect 1.8x1.575 hole 1.1: 1(-19.05,24.105) 41(16.51,24.155)
  round 1.8 hole 1.1: 2(-16.51,24.105) 3(-19.05,21.564) 4(-16.51,21.564) 5(-19.05,19.024) 6(-16.51,19.024) 7(-19.05,16.485) 8(-16.51,16.485) 9(-19.05,13.944) 10(-16.51,13.944) 11(-19.05,11.405) 12(-16.51,11.405) 13(-19.05,8.864) 14(-16.51,8.864) 15(-19.05,6.324) 16(-16.51,6.324) 17(-19.05,3.784) 18(-16.51,3.784) 19(-19.05,1.244) 20(-16.51,1.244) 21(-19.05,-1.296) 22(-16.51,-1.296) 23(-19.05,-3.836) 24(-16.51,-3.836) 25(-19.05,-6.375) 26(-16.51,-6.375) 27(-19.05,-8.915) 28(-16.51,-8.915) 29(-19.05,-11.456) 30(-16.51,-11.456) 31(-19.05,-13.995) 32(-16.51,-13.995) 33(-19.05,-16.535) 34(-16.51,-16.535) 35(-19.05,-19.076) 36(-16.51,-19.076) 37(-19.05,-21.616) 38(-16.51,-21.616) 39(-19.05,-24.155) 40(-16.51,-24.155) 42(19.05,24.155) 43(16.51,21.616) 44(19.05,21.616) 45(16.51,19.076) 46(19.05,19.076) 47(16.51,16.535) 48(19.05,16.535) 49(16.51,13.995) 50(19.05,13.995) 51(16.51,11.456) 52(19.05,11.456) 53(16.51,8.915) 54(19.05,8.915) 55(16.51,6.375) 56(19.05,6.375) 57(16.51,3.836) 58(19.05,3.836) 59(16.51,1.296) 60(19.05,1.296) 61(16.51,-1.244) 62(19.05,-1.244) 63(16.51,-3.784) 64(19.05,-3.784) 65(16.51,-6.324) 66(19.05,-6.324) 67(16.51,-8.864) 68(19.05,-8.864) 69(16.51,-11.405) 70(19.05,-11.405) 71(16.51,-13.944) 72(19.05,-13.944) 73(16.51,-16.485) 74(19.05,-16.485) 75(16.51,-19.024) 76(19.05,-19.024) 77(16.51,-21.564) 78(19.05,-21.564) 79(16.51,-24.105) 80(19.05,-24.105)
CONN-TH_XT60PB-F
  round 5.516 hole 4.505x4.5: +(3.6,0) -(-3.6,0)
DCDC
  round 2.5 hole 1.3: 1(-9.017,19.431) 2(-9.017,-19.304) 3(9.017,19.304) 4(9.017,-19.431)
HDR-TH_1P-V-M_XKB_X4611WV-01I-C28D40
  round 2 hole 1: 1(0,0)
HDR-TH_2P-P2.54-V-F
  rect 1.7x1.7 hole 1: 1(-1.27,0)
  round 1.7 hole 1: 2(1.27,0)
HDR-TH_4P-P2.54-V-M
  rect 1.7x1.7 hole 1.1: 1(-3.81,0)
  round 1.7 hole 1.1: 2(-1.27,0) 3(1.27,0) 4(3.81,0)
HDR-TH_5P-P2.54-V-M
  rect 1.7x1.7 hole 1.1: 1(-5.08,0)
  round 1.7 hole 1.1: 2(-2.54,0) 3(0,0) 4(2.54,0) 5(5.08,0)
HDR-TH_6P-P2.54-V-M-1
  rect 1.8x1.8 hole 1.2: 1(-6.35,0)
  round 1.8 hole 1.2: 2(-3.81,0) 3(-1.27,0) 4(1.27,0) 5(3.81,0) 6(6.35,0)
HDR-TH_8P-P2.54-V-F-R2-C4-S2.54-1
  rect 1.6x1.6 hole 1.1: 1(-3.81,-1.27)
  round 1.6 hole 1.1: 2(-3.81,1.27) 3(-1.27,-1.27) 4(-1.27,1.27) 5(1.27,-1.27) 6(1.27,1.27) 7(3.81,-1.27) 8(3.81,1.27)
HDR-TH_9P-P2.54-V-M
  rect 1.7x1.7 hole 1.1: 1(-10.16,0)
  round 1.7 hole 1.1: 2(-7.62,0) 3(-5.08,0) 4(-2.54,0) 5(0,0) 6(2.54,0) 7(5.08,0) 8(7.62,0) 9(10.16,0)
LED0603-RD
  rect 0.8x0.8 smd: 1(-0.749,0) 2(0.749,0)
R0603
  rect 0.806x0.864 smd: 1(-0.753,0) 2(0.753,0)
SOT-23-3_L2.9-W1.3-P1.90-LS2.4-BR
  rect 1.25x0.7 smd: 1(1,-0.95) 2(1,0.95) 3(-1,0)
SW-TH_4P-L6.0-W6.0-P4.50-LS6.3
  round 1.8 hole 1.2: 1(-3.15,2.25) 2(3.15,2.25) 3(-3.15,-2.25) 4(3.15,-2.25)
SW-TH_RS601HL-1010011BB
  oval 2x6 hole 1x5: 1(-2.5,0) 2(2.5,0)
TB6612模块
  round 1.524 hole 0.914: 1(7.366,2.032) 2(7.366,-0.508) 3(7.366,-3.048) 4(7.366,-5.588) 5(7.366,-8.128) 6(7.366,-10.668) 7(7.366,-13.208) 8(7.366,-15.748) 9(-7.62,-15.748) 10(-7.62,-13.208) 11(-7.62,-10.668) 12(-7.62,-8.128) 13(-7.62,-5.588) 14(-7.62,-3.048) 15(-7.62,-0.508) 16(-7.62,2.032)
Test-Point-0.5mm
  round 2 smd: 1(0,0)

## Nets
3V3: 2K.2 2K#2.2 2K#3.2 2K#4.2 8降3.3.4 10K#3.2 10K#4.2 100NF#2.1 100NF#3.1 100NF#4.1 100NF#5.1 100NF#6.1 100NF#7.1 100NF#8.1 220UF#2.1 ENABLE.1 Encount1.2 Encount2.2 ESP8266.2 ESP8266.6 GPS.5 NRF.2 OLED.2 TB6612.4 TB6612.15 U1.38 温湿度.1 蓝牙.5 陀螺仪.1
5V: 七路.8 人体传感.5
GND: 3V3LED.1 8降3.3.1 8降3.3.2 10K#2.1 10K#5.2 100nF.2 100NF.2 100NF#2.2 100nF#2.2 100NF#3.2 100nF#3.2 100NF#4.2 100NF#5.2 100NF#6.2 100NF#7.2 100NF#8.2 220UF.2 220UF#2.2 220UF#3.2 D10.3 D14.3 Encount1.5 Encount2.5 ESP8266.7 GPS.4 NRF.1 OLED.1 S8050.2 TB6612.8 TB6612.9 TB6612.14 U1.39 VM#2.- 七路.9 人体传感.4 总电源.1 温湿度.3 蓝牙.4 陀螺仪.4
VCC: 10K.2 VM#2.+ 主控开关.2 电机开关.2
EN: 蓝牙.6
IN+: 8降3.3.3 100nF.1 100nF#2.1 100nF#3.1 220UF#3.1 主控开关.1
NET100: Encount1.1
NET101: Encount1.6
NET102: Encount2.1
NET103: Encount2.6
OUT1+: OUT1+.1 OUT1+#2.1 TB6612.13
OUT1-: OUT1-.1 OUT1-#2.1 TB6612.12
OUT2+: OUT2+.1 OUT2+#2.1 TB6612.11
OUT2-: OUT2-.1 OUT2-#2.1 TB6612.10
PA0: Encount1.3 PA0.1 U1.3
PA1: Encount1.4 PA1.1 U1.4
PA2: U1.1 陀螺仪.2
PA3: U1.6 陀螺仪.3
PA4: NRF.8 U1.5
PA5: NRF.5 U1.8
PA6: TB6612.1 U1.7
PA7: TB6612.7 U1.10
PA8: OLED.3 U1.74
PA15: U1.73 七路.7
PB1: TB6612.3 U1.14
PB4: NRF.7 U1.65
PB5: NRF.6 U1.64
PB6: NRF.3 U1.63
PB7: NRF.4 U1.62
PB8: U1.61 温湿度.4
PB9: U1.60 温湿度.2
PB10: ESP8266.1 U1.23
PB11: ESP8266.8 U1.24
PC5: TB6612.2 U1.12
PC6: U1.75 人体传感.2
PC7: U1.76 人体传感.1
PC9: OLED.4 U1.42
PC10: GPS.2 U1.47
PC11: GPS.3 U1.46
PC12: U1.44 蓝牙.2
PD0: U1.72 七路.6
PD1: U1.71 七路.5
PD2: U1.45 蓝牙.3
PD4: U1.70 七路.4
PD5: U1.69 七路.3
PD6: U1.68 七路.2
PD7: U1.67 七路.1
PD8: D8.1 U1.30
PD9: D9.1 U1.29
PD10: 10K#3.1 D10.2 U1.32
PD11: D11.1 U1.31
PD12: D12.1 Encount2.3 U1.34
PD13: D13.1 Encount2.4 U1.33
PD14: 10K#4.1 D14.2 U1.36
PD15: 10K#6.1 U1.35
PE0: U1.59 人体传感.3
PE8: TB6612.5 U1.16
PE10: TB6612.6 U1.18
PPS: GPS.1
STATE: 蓝牙.1
VM: 100NF.1 220UF.1 TB6612.16 VM.2 电机开关.1
$1N3354: BUZZER.1 ENABLE.2
$1N3360: BUZZER.2 S8050.3
$1N3368: 10K#5.1 10K#6.2 S8050.1
$1N3685: 2K#2.1 D8.2
$1N3689: 2K#4.1 D9.2
$1N3691: 2K#3.1 D11.2
$1N4248: 2K.1 3V3LED.2
$1N4262: 10K#2.2 VM.1
$1N4311: 10K.1 总电源.2

Pads without a net: D10 1 4; D14 1 4; ESP8266 3 4 5; U1 2 9 11 13 15 17 19 20 21 22 25 26 27 28 37 40 41 43 48 49 50 51 52 53 54 55 56 57 58 66 77 78 79 80

## Via types
v1: diameter 0.61, hole 0.305, Top Layer to Bottom Layer, 75 vias

## Routing (per net, layer and track width the routed paths; a pad name or vN(x,y) marks a point on that pad's centre or on a via; arc(x,y) is an arc through that point)
3V3: length 452.3
  Top Layer w0.254: 10K#4.2 v1(15.11,10.72) ; 38.61,27.42 37.02,27.42 v1(36.83,27.23) ; 220UF#2.1 82.81,96.5 81.51,96.5 81.33,96.32 81.33,94.21 81.15,94.03 59.31,94.03 57.02,96.32 OLED.2 ; 陀螺仪.1 19.81,11.1 20.19,10.72 10K#3.2 v1(30.74,21.77) ; 100NF#4.1 18.86,69.46 19.18,69.77 19.18,71.3 19.36,71.48 21.92,71.48 TB6612.15 v1(26.03,71.43) 26.03,77.52 26.8,78.28 77.34,78.28 77.72,78.66 77.72,80.19 79.38,81.84 100NF#3.1 ; v1(13.59,44.12) 23.88,44.12 25.91,42.09 28.57,42.09 29.21,42.72 ENABLE.1 32.38,44.25 32.89,44.76 2K#2.2 2K#4.2 2K#3.2 34.04,34.1 v1(34.04,34.09) ; ESP8266.6 v1(10.72,44.12) 10.72,48.39 9.91,49.2 ESP8266.2 ; TB6612.4 30.73,66.35 30.48,66.6 v1(30.48,71.43)
  Top Layer w0.4: 48.51,20.98 51.71,20.98 52.13,20.56 54.77,20.56 55.17,20.16 v1(55.17,19.42) ; NRF.2 98.68,35.36 99.44,34.6 99.44,23.29 96.66,20.51 温湿度.1 96.4,16.81 69.6,16.81 v1(69.17,17.25) v1(68.51,17.25) v1(67.86,17.25) v1(67.22,17.25)
  Top Layer w0.8: 97.73,40.44 97.73,35.8 NRF.2
  Top Layer w1: 86.28,95 86.33,95.05 蓝牙.5 96.83,95.05 97.54,94.34 97.54,70.28 97.33,70.08 98.38,70.08 98.55,69.9 98.55,47.42 97.84,46.72 ; 86.28,95 86.28,90.86 ; 86.28,95 86.28,96.65 85.55,97.38 220UF#2.1 82.72,98.35 8降3.3.4 ; 86.28,90.86 2K.2 ; 86.28,90.86 86.28,90.86 81.41,90.86 81.22,90.66 100NF#7.1 100NF#8.1 100NF#3.1 ; Encount1.2 95.74,46.72 97.84,46.72 ; 97.84,46.72 97.73,46.6 97.73,40.44 ; 97.09,69.83 95.57,69.83
  Bottom Layer w0.254: v1(15.11,10.72) 15.11,17.2 15.62,17.7 陀螺仪.1 19.81,22.4 19.43,22.78 Encount2.2 ; v1(34.04,34.09) 36.32,34.09 36.58,33.83 36.58,27.48 36.78,27.28 30.92,27.28 30.74,27.1 v1(30.74,21.77) ; v1(26.03,71.43) v1(30.48,71.43) ; 48.51,20.98 47.27,19.74 37.59,19.74 36.83,20.5 v1(36.83,27.23) ; v1(13.59,44.12) v1(10.72,44.12)
  Bottom Layer w0.4: v1(55.17,18.76) v1(55.17,18.13) 55.17,17.56 55.53,17.2 55.58,17.25 v1(67.22,17.25)
  vias: v1(55.17,20.08) v1(55.83,20.08) v1(55.83,19.42) v1(55.83,18.76) v1(55.83,18.13) v1(67.22,17.91) v1(67.86,17.91) v1(68.51,17.91) v1(69.17,17.91)
5V: length 85.3
  Top Layer w0.5: 七路.8 63.37,3.99 63.75,4.37 80.77,4.37 81.53,3.61 81.53,1.58
  Bottom Layer w0.5: 七路.8 63.37,14.4 62.1,15.67 51.94,15.67 51.31,16.31 51.31,45.39 52.83,46.91 58.42,46.91
VCC: length 58.7
  Top Layer w1: 10K.2 18.15,91.75 17.78,92.13 17.78,94.29 17.53,94.54 VM#2.+ 12.49,90.29 11.78,89.59 8.64,89.59 8.04,88.99 主控开关.2 ; 7.62,83.87 7.87,83.62 7.87,79.57 6.91,78.61 2.99,78.61 2.29,77.9 2.29,61.39 2.67,61.01 电机开关.2
IN+: length 40.8
  Top Layer w1: 8降3.3.3 36.76,98.68 33.04,98.68 32.33,97.97 32.33,94.51 31.62,93.81 220UF#3.1 28.13,93.74 100nF#2.1 100nF.1 100nF#3.1 16.13,81.71 14.86,82.98 主控开关.1
OUT1+: length 50.8
  Top Layer w0.8: OUT1+#2.1 2.64,32.73 OUT1+.1
  Bottom Layer w0.8: OUT1+#2.1 10.96,32.73 16.26,38.02 16.26,65.46 17.14,66.35 TB6612.13
OUT1-: length 51.6
  Top Layer w0.8: OUT1-.1 3.4,28.34 OUT1-#2.1
  Bottom Layer w0.8: OUT1-.1 13.68,29.74 18.03,34.09 18.03,62.54 19.3,63.81 TB6612.12
OUT2+: length 100.7
  Top Layer w0.8: OUT2+#2.1 93.88,65.56 93.88,64.85 ; 93.88,64.85 93.7,64.85 93.09,65.46 93.09,70.39 v1(93.49,70.79) ; 93.88,64.85 OUT2+.1 ; 75.18,76 74.24,76.94 27.87,76.94 27.3,76.38 27.3,63.81 24.77,61.27 TB6612.11
  Bottom Layer w0.8: v1(74.8,76.1) v1(75.44,76.1) v1(76.1,76.1) v1(76.74,76.1) 92.58,76.1 93.15,75.54 93.15,72.95 ; v1(76.74,76.76) v1(76.1,76.76) v1(75.44,76.76) v1(74.8,76.76)
  vias: v1(92.84,72.73) v1(92.84,72.08) v1(92.84,71.43) v1(92.84,70.79) v1(93.49,72.73) v1(93.49,72.08) v1(93.49,71.43)
OUT2-: length 99.6
  Top Layer w0.8: 73.28,74.47 72.14,75.62 30.35,75.62 29.08,74.35 29.08,62.41 25.4,58.73 TB6612.10 ; OUT2-.1 95.63,60.5 OUT2-#2.1 92.71,60.5 91.31,61.9 91.31,71.93
  Bottom Layer w0.8: 91.31,71.3 91.31,73.08 90.57,73.82 v1(75.47,73.82)
  vias: v1(73.53,74.47) v1(73.53,73.82) v1(74.17,74.47) v1(74.17,73.82) v1(74.83,74.47) v1(74.83,73.82) v1(75.47,74.47) v1(90.93,71.97) v1(90.93,71.32) v1(90.93,70.66) v1(90.93,70.03) v1(91.59,71.97) v1(91.59,71.32) v1(91.59,70.66) v1(91.59,70.03)
PA0: length 62.2
  Top Layer w0.254: Encount1.3 93.1,49.33 93.09,49.32 PA0.1 89.97,49.28 89.28,49.96 89.28,54.53 88.47,55.35 80.08,55.35 79.5,55.93 79.5,56.69 79.32,56.87 68.71,56.87 68.2,57.38 68.2,62.28 67.56,62.92 46.74,62.92 45.97,63.68 U1.3
PA1: length 58.3
  Top Layer w0.254: 48.51,64.16 68.61,64.16 69.22,63.55 69.22,58.47 69.85,57.84 89.79,57.84 90.37,57.25 90.37,52 90.55,51.82 PA1.1 95.62,51.82 Encount1.4
PA2: length 76.4
  Bottom Layer w0.254: 陀螺仪.2 22.35,33.83 24.38,35.87 30.73,35.87 32.89,38.02 32.89,69.52 33.53,70.16 45.47,70.16 45.97,69.65 U1.1
PA3: length 75.7
  Bottom Layer w0.254: 陀螺仪.3 24.89,34.09 25.27,34.47 30.73,34.47 34.29,38.02 34.29,67.11 34.8,67.62 43.31,67.62 43.81,67.11 43.81,63.3 44.2,62.92 47.37,62.92 48.51,61.77 48.51,61.62
PA4: length 80.2
  Top Layer w0.254: U1.5 46.51,61.62 47.24,60.88 47.24,58.22 47.62,57.84 64.77,57.84 65.79,56.82 65.79,55.93 66.67,55.04 74.29,55.04 75.44,53.9 75.44,36.12 79.12,32.44 85.34,32.44 91.57,26.21 97.03,26.21 98.17,27.36 NRF.8
PA5: length 70.5
  Top Layer w0.254: 48.51,59.08 66.7,59.08 67.06,58.73 67.06,56.82 67.94,55.93 75.95,55.93 76.84,55.04 76.84,40.95 v1(79.15,38.63) 80.33,37.45 86.81,37.45 87.76,36.5 87.76,32.94 90.42,30.28 NRF.5
PA6: length 23.1
  Top Layer w0.254: TB6612.1 42.29,73.97 43.18,73.08 43.18,59.49 43.59,59.08 U1.7
PA7: length 12.5
  Bottom Layer w0.254: 48.51,56.54 47.22,57.84 43.81,57.84 42.93,58.73 TB6612.7
PA8: length 91.3
  Top Layer w0.254: v1(71.5,41.2) 71.5,42.85 57.86,56.49 v1(57.78,56.49)
  Bottom Layer w0.254: v1(71.5,41.2) 71.5,27.74 71.88,27.36 82.83,27.36 84.07,26.11 ; v1(57.78,56.49) 54.48,59.79 OLED.3
PA15: length 41.2
  Top Layer w0.254: 七路.7 60.83,5 65.91,10.08 65.91,24.44 67.59,26.11 U1.73
PB1: length 27.6
  Top Layer w0.254: 48.51,51.46 48.51,51.87 47.62,52.76 42.16,52.76 41.66,53.26 41.66,68 40.77,68.89 TB6612.3
PB4: length 18.6
  Top Layer w0.254: NRF.7 91.57,27.74 87.12,32.18 87.12,33.83 85.98,34.98 82.8,34.98 81.53,36.25 U1.65
PB5: length 20.3
  Top Layer w0.254: NRF.6 98.17,30.79 97.41,31.55 90.55,31.55 88.39,33.71 88.39,37.77 87.35,38.81 84.07,38.81
PB6: length 20.7
  Top Layer w0.254: 82.79,40.05 88.52,40.05 89.03,39.54 89.03,34.34 90.55,32.82 95.5,32.82 95.63,32.69 ; 81.56,38.81 U1.63 82.77,40.05
PB7: length 21.1
  Top Layer w0.254: 84.07,41.35 89.13,41.35 89.66,40.82 89.66,38.91 90.17,38.41 96.65,38.41 96.9,38.15 96.9,34.09 NRF.4
PB8: length 44.2
  Bottom Layer w0.254: U1.61 81.53,41.33 82.8,40.06 90.68,40.06 91.31,39.42 91.31,12.37 94.23,9.45 温湿度.4
PB9: length 41.2
  Top Layer w0.254: 84.07,43.89 92.05,43.89 v1(92.46,43.49)
  Bottom Layer w0.254: v1(92.46,43.49) 92.84,43.1 92.84,15.04 93.34,14.53 温湿度.2
PB10: length 50.2
  Top Layer w0.254: U1.23 45.87,38.66 44.7,38.66 43.43,39.93 43.43,44.37 v1(40.79,47.01) 12.22,47.01 11.81,47.42 11.81,49.71 10.8,50.72 6.35,50.72 6.1,50.47 ESP8266.1
PB11: length 49.7
  Top Layer w0.254: 48.51,38.76 48.51,38.53 47.5,37.52 44.45,37.52 42.29,39.68 42.29,43.74 40.13,45.9 12.06,45.9 11.81,45.64 11.81,42.98 10.41,41.58 ESP8266.8
PC5: length 27.3
  Top Layer w0.254: 48.51,54 48.51,54.28 47.5,55.3 43.43,55.3 42.42,56.31 42.42,70.66 41.66,71.43 TB6612.2
PC6: length 28.9
  Bottom Layer w0.254: 73.91,1.58 73.91,22.28 75.21,23.57 U1.75
PC7: length 34.4
  Bottom Layer w0.254: 82.7,24.82 82.03,24.82 82.02,24.81 81.05,24.81 81.03,24.82 74.93,24.82 71.37,21.26 71.37,1.45 ; 82.83,24.82 84.07,23.57
PC9: length 91.5
  Top Layer w0.254: OLED.4 51.94,96.32 53.97,94.29 v1(57.53,94.29)
  Bottom Layer w0.254: 84.07,66.75 84.07,69.52 83.82,69.77 58.17,69.77 57.53,70.41 57.53,72.67 57.71,72.85 59.64,72.85 59.82,73.03 59.82,74.19 59.64,74.37 57.71,74.37 57.53,74.55 57.53,75.72 57.71,75.9 59.64,75.9 59.82,76.08 59.82,77.24 59.64,77.42 57.71,77.42 57.53,77.6 57.53,78.77 57.71,78.95 59.64,78.95 59.82,79.13 59.82,80.29 59.64,80.47 57.71,80.47 57.53,80.65 57.53,81.81 57.71,81.99 59.64,81.99 59.82,82.17 59.82,83.34 59.64,83.52 57.71,83.52 57.53,83.7 57.53,84.86 57.71,85.04 59.64,85.04 59.82,85.22 59.82,86.39 59.64,86.57 57.71,86.57 57.53,86.75 57.53,87.91 57.71,88.09 59.64,88.09 59.82,88.27 59.82,89.43 59.64,89.61 57.71,89.61 57.53,89.79 57.53,90.96 57.71,91.14 59.64,91.14 59.82,91.32 59.82,92.48 59.64,92.66 57.71,92.66 57.53,92.84 v1(57.53,94.29)
PC10: length 31.3
  Top Layer w0.254: U1.47 81.53,59.74 82.17,60.38 87.5,60.38 88.26,61.14 88.26,76.89 88.9,77.52 GPS.2
PC11: length 24.7
  Top Layer w0.254: v1(89.15,63.55) 89.15,74.47 89.66,74.98 GPS.3 ; 84.07,61.67 84.23,61.52 87.12,61.52 87.25,61.65 v1(87.25,63.55)
  Bottom Layer w0.254: v1(89.15,63.55) v1(87.25,63.55)
PC12: length 32.4
  Top Layer w0.254: 蓝牙.2 90.68,87.43 90.04,86.79 90.04,79.93 87.45,77.34 87.45,65.15 86.51,64.21 84.07,64.21
PD0: length 48.1
  Top Layer w0.254: 84.07,28.65 84.07,28.25 83.19,27.36 65.28,27.36 64.39,26.47 64.39,11.23 58.29,5.13 七路.6
PD1: length 47.9
  Top Layer w0.254: U1.71 64.03,28.65 62.74,27.36 62.74,12.12 55.75,5.13 七路.5
PD2: length 47.1
  Top Layer w0.254: 蓝牙.3 89.92,89.97 89.53,89.59 89.53,80.32 88.9,79.68 79.63,79.68 78.43,78.48 78.43,62.08 78.84,61.67 U1.45
PD4: length 54
  Top Layer w0.254: 84.07,31.19 84.07,31.17 82.8,29.9 62.74,29.9 61.09,28.25 61.09,13.13 53.21,5.26 七路.4
PD5: length 53.7
  Top Layer w0.254: 七路.3 50.67,5.26 59.56,14.15 59.56,28.75 62,31.19 U1.69
PD6: length 60.6
  Top Layer w0.254: 七路.2 48.13,5.39 58.29,15.55 58.29,30.91 59.44,32.06 74.32,32.06 v1(74.69,32.43)
  Bottom Layer w0.254: 84.07,33.6 84.07,33.06 83.44,32.43 v1(74.69,32.43)
PD7: length 60.3
  Top Layer w0.254: v1(73.53,33.83) 73.03,33.33 58.42,33.33 57.15,32.06 57.15,17.45 45.59,5.89 七路.1
  Bottom Layer w0.254: v1(73.53,33.83) 81.43,33.83 U1.67
PD8: length 19.5
  Top Layer w0.254: 48.51,31.14 48.51,31.29 47.37,32.44 43.69,32.44 43.31,32.82 43.31,37.77 41.15,39.93 41.15,42.75 D8.1
PD9: length 13.9
  Top Layer w0.254: D9.1 39.94,40.25 42.11,38.08 42.11,32.23 43.05,31.29 45.82,31.29 U1.29
PD10: length 35.9
  Top Layer w0.254: 48.51,28.6 48.51,28.37 47.5,27.36 v1(42.42,27.36) ; v1(42.42,22.28) 42.16,22.02 34.04,22.02 32.25,20.24 10K#3.1 32.25,10.69 32.91,10.03 32.91,9.88 D10.2
  Bottom Layer w0.254: v1(42.42,27.36) v1(42.42,22.28)
PD11: length 12.8
  Top Layer w0.254: U1.31 42.8,28.6 41.4,30 41.4,35.23 40.8,35.83 D11.1
PD12: length 50.9
  Top Layer w0.254: Encount2.3 6.86,20.24 8.13,21.51 8.13,23.93 9.02,24.82 47.27,24.82 48.51,26.06
  Top Layer w0.8: D12.1 1.53,20.24 Encount2.3
PD13: length 51.3
  Top Layer w0.254: v1(40,23.17) 39.75,22.91 9.65,22.91 8.76,22.02 8.76,19.36 7.11,17.7 Encount2.4 ; U1.33 45.95,26.09 v1(40.13,26.09)
  Top Layer w0.8: Encount2.4 4.41,17.42 D13.1
  Bottom Layer w0.254: v1(40.13,26.09) 40,25.96 v1(40,23.17)
PD14: length 47.9
  Top Layer w0.254: 48.51,23.52 47.27,22.28 43.56,22.28 43.05,21.77 43.05,19.99 42.8,19.74 v1(33.27,19.74) ; D14.2 19.06,9.76 19.06,10.03 18.41,10.69 10K#4.1 18.41,12.7 18.23,12.88 16.89,12.88 16.51,13.26 16.51,18.34 17.78,19.61 v1(29.34,19.61)
  Bottom Layer w0.254: v1(29.34,19.61) 33.15,19.61 v1(33.27,19.74)
PD15: length 15.3
  Top Layer w0.254: 10K#6.1 40.08,31.73 40.64,31.17 40.64,27.48 v1(41.02,27.1) ; U1.35 45.62,23.17 v1(41.15,23.17)
  Bottom Layer w0.254: v1(41.15,23.17) 41.15,26.98 v1(41.02,27.1)
PE0: length 58.4
  Top Layer w0.254: 人体传感.3 76.45,2.84 75.82,3.48 v1(70.48,3.48)
  Bottom Layer w0.254: v1(70.48,3.48) 70.48,42.85 71.53,43.89 U1.59
PE8: length 25
  Top Layer w0.254: 48.51,48.92 48.51,49.2 47.5,50.22 41.28,50.22 40.89,50.6 40.89,62.66 39.75,63.81 TB6612.5
PE10: length 23.8
  Top Layer w0.254: TB6612.6 38.73,61.27 40,60 40,49.96 42.29,47.68 47.5,47.68 48.51,46.66 48.51,46.38
VM: length 33
  Top Layer w1: 8.81,73.56 11.34,73.56 100NF.1 14.82,72.84 VM.2 14.85,73.83 15.24,74.22 21.72,74.22 TB6612.16 ; 8.81,73.56 220UF.1 ; 8.81,73.56 8.69,73.43 8.69,66.04 9.4,65.33 11.94,65.33 13.04,64.23 电机开关.1
$1N3354: length 7
  Bottom Layer w0.254: ENABLE.2 26.67,39 BUZZER.1
$1N3360: length 8.4
  Top Layer w0.254: BUZZER.2 30.48,37.73 30.48,31.17 30.73,30.91 S8050.3
$1N3368: length 4.8
  Top Layer w0.254: 10K#6.2 10K#5.1 36.06,29.96 S8050.1
$1N3685: length 2.2
  Top Layer w0.254: D8.2 35.64,44.67 2K#2.1
$1N3689: length 2.2
  Top Layer w0.254: 2K#4.1 35.56,40.25 D9.2
$1N3691: length 2.2
  Top Layer w0.254: D11.2 35.65,35.83 2K#3.1
$1N4248: length 3.4
  Top Layer w0.254: 2K.1 87.79,85.97 87.74,85.92 3V3LED.2
$1N4262: length 3.9
  Top Layer w0.254: VM.1 15.51,71.31 15.75,71.55 15.75,72.57 16,72.82 10K#2.2
$1N4311: length 1.9
  Top Layer w1: 10K.1 总电源.2

## Copper pours and planes (outline as drawn; the poured copper is in the pictures)
3V3 on Top Layer: 54.72,20.37 56.13,20.37 56.13,17.83 54.72,17.83
3V3 on Top Layer: 96.91,70.88 99.06,70.88 99.06,69.27 96.91,69.27
3V3 on Top Layer: 66.93,18.21 69.52,18.21 69.52,17.07 66.93,17.07
3V3 on Top Layer: 97.16,47.55 99.19,47.55 99.19,46.15 97.16,46.15
3V3 on Top Layer: 36.32,27.86 37.34,27.86 37.34,26.59 36.32,26.59
3V3 on Bottom Layer: 54.72,20.37 56.13,20.37 56.13,17.83 54.72,17.83
3V3 on Bottom Layer: 66.93,18.21 69.47,18.21 69.47,16.81 66.93,16.81
3V3 on Bottom Layer: 36.32,27.86 37.34,27.86 37.34,26.59 36.32,26.59
5V on Bottom Layer: 60.7,47.06 60.67,47.36 60.59,47.65 60.47,47.93 60.32,48.19 60.14,48.42 59.93,48.64 59.69,48.82 59.43,48.97 59.16,49.08 58.87,49.16 58.57,49.2 58.27,49.2 57.97,49.16 57.68,49.08 57.41,48.97 57.15,48.82 56.91,48.64 56.7,48.42 56.52,48.19 56.37,47.93 56.25,47.65 56.17,47.36 56.14,47.06 56.14,46.76 56.17,46.47 56.25,46.18 56.37,45.9 56.52,45.64 56.7,45.4 56.91,45.19 57.15,45.01 57.41,44.86 57.68,44.75 57.97,44.67 58.27,44.63 58.57,44.63 58.87,44.67 59.16,44.75 59.43,44.86 59.69,45.01 59.93,45.19 60.14,45.4 60.32,45.64 60.47,45.9 60.59,46.18 60.67,46.47 60.7,46.76
GND on Top Layer: -36.83,135.94 143.13,135.94 143.13,-54.81 -36.83,-54.81
GND on Bottom Layer: -67.95,146.61 140.46,146.61 140.46,-47.32 -67.95,-47.32
OUT2+ on Top Layer: 74.42,77.14 76.96,77.14 76.96,75.74 74.42,75.74
OUT2+ on Top Layer: 92.63,72.95 93.73,72.95 93.73,70.54 92.63,70.54
OUT2+ on Bottom Layer: 74.42,77.14 77.09,77.14 77.09,75.74 74.42,75.74
OUT2+ on Bottom Layer: 92.71,72.95 93.73,72.95 93.73,70.54 92.71,70.54
OUT2- on Top Layer: 90.55,72.31 91.95,72.31 91.95,69.77 90.55,69.77
OUT2- on Top Layer: 73.03,74.88 75.95,74.88 75.95,73.33 73.03,73.33
OUT2- on Bottom Layer: 73.03,74.88 75.95,74.88 75.95,73.33 73.03,73.33
OUT2- on Bottom Layer: 90.55,72.31 91.95,72.31 91.95,69.77 90.55,69.77
VM on Top Layer: 5.46,74.09 9.88,74.09 9.88,71.77 5.46,71.77

## Text on the board
Bottom Solder Mask Layer: 5V
Top Silkscreen Layer: VCC | GND | A2 | A3 | 3V3 | PA1 | PA0 | D7 | D6 | D5 | D4 | D1 | D0 | A15 | 5V | C7 | C6 | E0 | PPS | C10 | C11 | EN | D2 | C12 | STA | PC9 | PA8 | + | —> | B8 | B9 | B11 | B10
